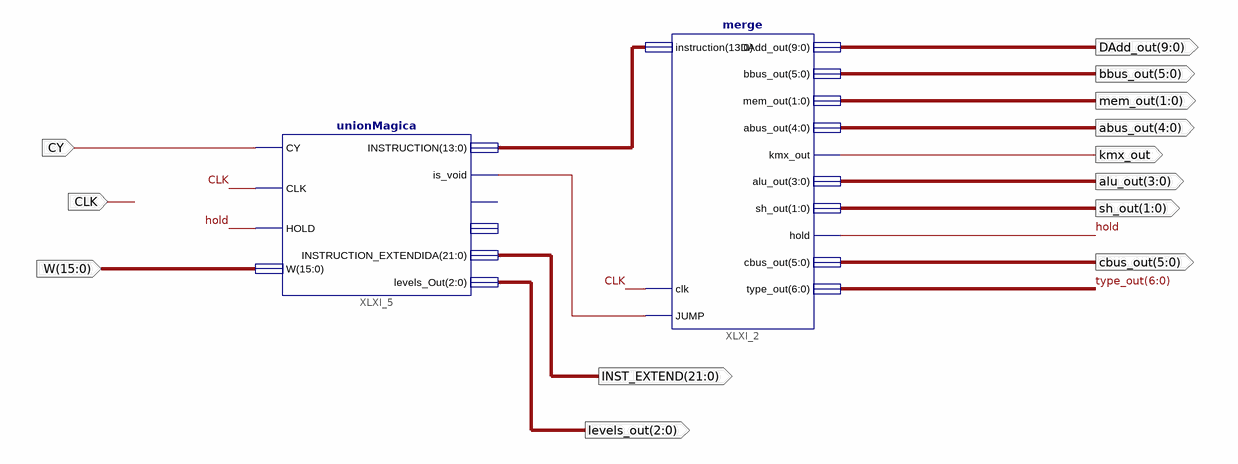
[diagram p0: schematic sheet 1]
// Xilinx ISE schematic merge_conIR.sch (artix7) as structural Verilog: 2 symbols, 13 ports
module merge_conIR (
  input  CY,
  input  CLK,
  input  [15:0] W,
  output [9:0] DAdd_out,
  output [5:0] bbus_out,
  output [1:0] mem_out,
  output [4:0] abus_out,
  output kmx_out,
  output [3:0] alu_out,
  output [1:0] sh_out,
  output [5:0] cbus_out,
  output [21:0] INST_EXTEND,
  output [2:0] levels_out
);

  wire hold, XLXN_49;
  wire [6:0] type_out;
  wire [13:0] XLXN_32;

  merge XLXI_2 (
    .instruction(XLXN_32), .clk(CLK), .JUMP(XLXN_49), .DAdd_out(DAdd_out), .bbus_out(bbus_out),
    .mem_out(mem_out), .abus_out(abus_out), .kmx_out(kmx_out), .alu_out(alu_out), .sh_out(sh_out),
    .hold(hold), .cbus_out(cbus_out), .type_out(type_out));
  unionMagica XLXI_5 (
    .CY(CY), .CLK(CLK), .HOLD(hold), .W(W), .INSTRUCTION(XLXN_32), .is_void(XLXN_49),
    .INSTRUCTION_EXTENDIDA(INST_EXTEND), .levels_Out(levels_out));  // open: increment, PC
endmodule
